# EAGLE schematic ga_panel (EAGLE 9.3.0)
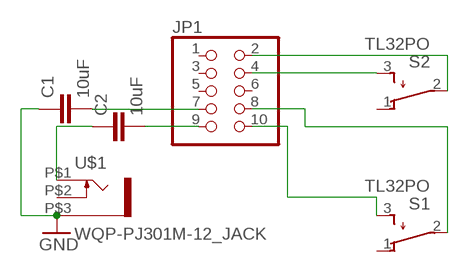
[diagram p0: schematic, sheet 1]

## Parts
C1  10uF  C5/3.5  [C5B3.5]
C2  10uF  C5/3.5  [C5B3.5]
JP1  PINHD-2X5  [2X05]
S1  TL32PO  [TL3XPO]
S2  TL32PO  [TL3XPO]
U$1  WQP-PJ301M-12_JACK  [WQP-PJ301M-12_JACK]

## Nets
GND: C1.1 U$1.P$3
N$1: JP1.4 S2.3(S)
N$2: JP1.2 S2.2(P)
N$3: C1.2 JP1.7
N$4: JP1.10 S1.3(S)
N$5: C2.1 U$1.P$1
N$6: C2.2 JP1.9
N$7: JP1.8 S1.2(P)
Unconnected: JP1.1 JP1.3 JP1.5 JP1.6 S1.1(O) S2.1(O) U$1.P$2

## Library data of the parts
C1 C2 = capacitor-wima:C: CAPACITOR naming: grid - package width
JP1 = pinhead:PINHD-2X5: PIN HEADER
S1 S2 = switch:TL32PO: TINY SWITCH ON - MOM Source: http://www2.produktinfo.conrad.com/datenblaetter/700000-724999/705152-da-01-de-Subminiaturschalter_TL_36YO.pdf
U$1 = thonkiconn:WQP-PJ301M-12_JACK